# EAGLE design mainboard (EAGLE 8.0.0)
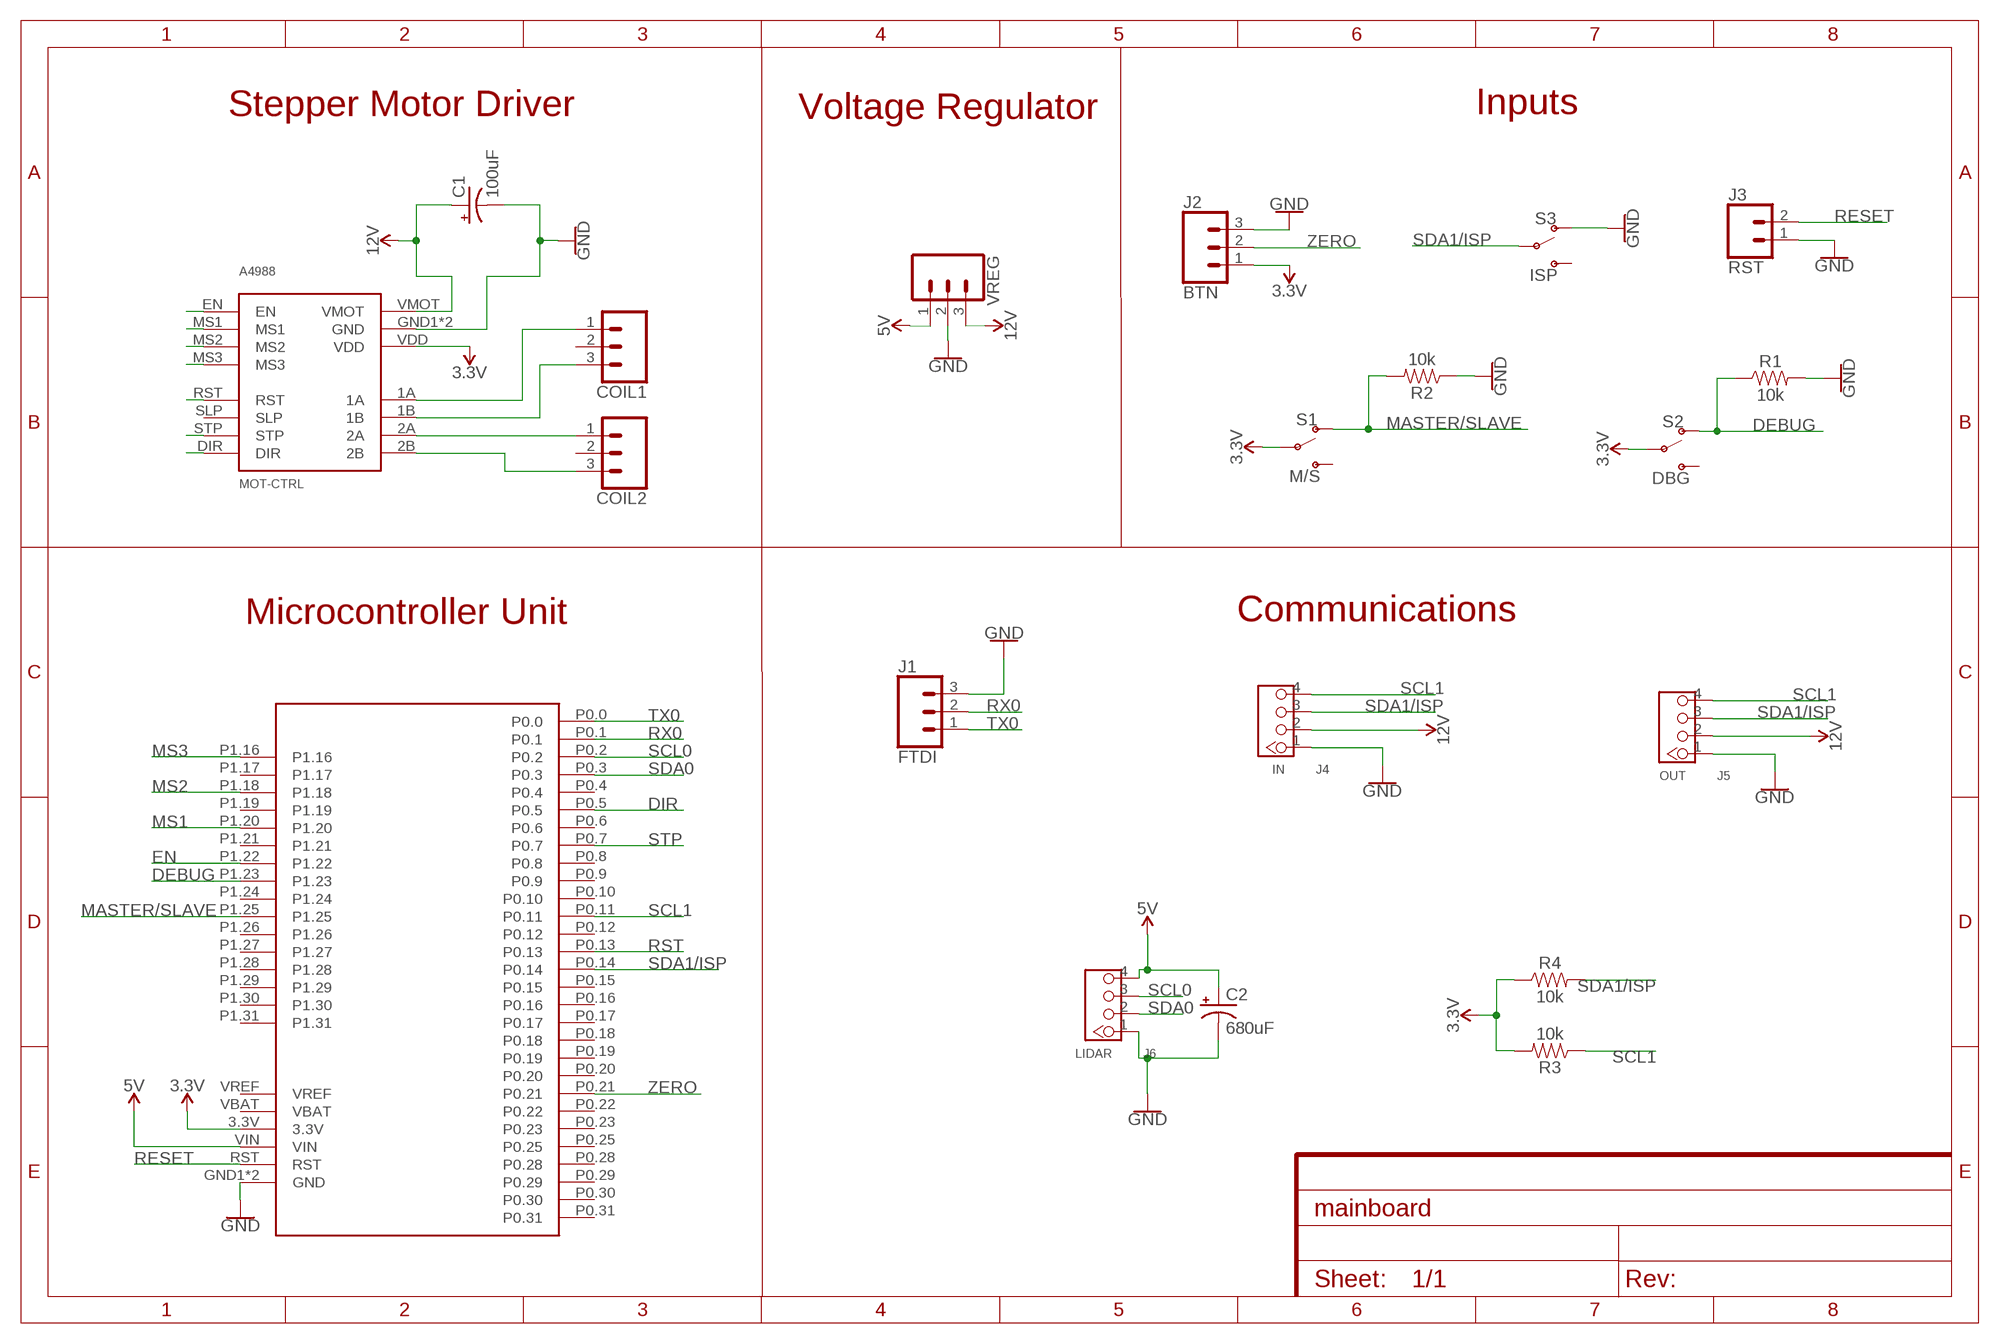
[diagram p0: schematic, sheet 1]
FRAME1 (FRAME-A4L): CNAME: AC3E; CREVISION: 2; DESIGNER: Javier Torres Bustos

## Parts
A4988  MOT-CTRL  [POLOLU-6X8]
C1  100uF  100UF-POLAR-RADIAL-2.5MM-25V-20%  [CPOL-RADIAL-2.5MM-6.5MM]
C2  680uF  100UF-POLAR-RADIAL-2.5MM-25V-20%  [CPOL-RADIAL-2.5MM-6.5MM]
COIL1  CONN_03-SCREW-5MM  [SCREWTERMINAL-5MM-3]
COIL2  CONN_03-SCREW-5MM  [SCREWTERMINAL-5MM-3]
J1  FTDI  CONN_03  [1X03]
J2  BTN  CONN_03  [1X03]
J3  RST  CONN_02  [1X02]
J4  IN  GROVE-CONNECTOR-DIP(4P-2.0)  [HW4-2.0]
J5  OUT  GROVE-CONNECTOR-DIP(4P-2.0)  [HW4-2.0]
J6  LIDAR  GROVE-CONNECTOR-DIP(4P-2.0)  [HW4-2.0]
LPC2148  MCU  [LPC-H2148]
R1  10k  10KOHM-HORIZ-1/4W-1%  [AXIAL-0.3]
R2  10k  10KOHM-HORIZ-1/4W-1%  [AXIAL-0.3]
R3  10k  10KOHM-HORIZ-1/4W-1%  [AXIAL-0.3]
R4  10k  10KOHM-HORIZ-1/4W-1%  [AXIAL-0.3]
S1  M/S  SWITCH-SPDT-PTH-11.6X4.0MM  [SWITCH_SPDT_PTH_11.6X4.0MM]
S2  DBG  SWITCH-SPDT-PTH-11.6X4.0MM  [SWITCH_SPDT_PTH_11.6X4.0MM]
S3  ISP  SWITCH-SPDT-PTH-11.6X4.0MM  [SWITCH_SPDT_PTH_11.6X4.0MM]
VREG  CONN_03  [1X03]

## Nets
3.3V: A4988.VDD J2.1 LPC2148.3.3V R3.P$2 R4.P$1 S1.2(P) S2.2(P)
5V: C2.1(+) J6.4 LPC2148.VIN VREG.1
12V: A4988.VMOT C1.1(+) J4.2 J5.2 VREG.3
DEBUG: LPC2148.P1.23 R1.P$1 S2.1(O)
DIR: A4988.DIR LPC2148.P0.5
EN: A4988.EN LPC2148.P1.22
GND: A4988.GND1(GND) A4988.GND2(GND) C1.2(-) C2.2(-) J1.3 J2.3 J3.1 J4.1 J5.1 J6.1 LPC2148.GND1(GND) LPC2148.GND2(GND) R1.P$2 R2.P$1 S3.1(O) VREG.2
MASTER/SLAVE: LPC2148.P1.25 R2.P$2 S1.1(O)
MS1: A4988.MS1 LPC2148.P1.20
MS2: A4988.MS2 LPC2148.P1.18
MS3: A4988.MS3 LPC2148.P1.16
N$1: A4988.2B COIL2.3
N$2: A4988.2A COIL2.1
N$3: A4988.1B COIL1.3
N$4: A4988.1A COIL1.1
RESET: J3.2 LPC2148.RST
RST: A4988.RST LPC2148.P0.13
RX0: J1.2 LPC2148.P0.1
SCL0: J6.3 LPC2148.P0.2
SCL1: J4.4 J5.4 LPC2148.P0.11 R3.P$1
SDA0: J6.2 LPC2148.P0.3
SDA1/ISP: J4.3 J5.3 LPC2148.P0.14 R4.P$2 S3.2(P)
STP: A4988.STP LPC2148.P0.7
TX0: J1.1 LPC2148.P0.0
ZERO: J2.2 LPC2148.P0.21
Unconnected: A4988.SLP COIL1.2 COIL2.2 LPC2148.P0.4 LPC2148.P0.6 LPC2148.P0.8 LPC2148.P0.9 LPC2148.P0.10 LPC2148.P0.12 LPC2148.P0.15 LPC2148.P0.16 LPC2148.P0.17 LPC2148.P0.18 LPC2148.P0.19 LPC2148.P0.20 LPC2148.P0.22 LPC2148.P0.23 LPC2148.P0.25 LPC2148.P0.28 LPC2148.P0.29 LPC2148.P0.30 LPC2148.P0.31 LPC2148.P1.17 LPC2148.P1.19 LPC2148.P1.21 LPC2148.P1.24 LPC2148.P1.26 LPC2148.P1.27 LPC2148.P1.28 LPC2148.P1.29 LPC2148.P1.30 LPC2148.P1.31 LPC2148.VBAT LPC2148.VREF S1.3(S) S2.3(S) S3.3(S)

## Notes on the sheet
- Stepper Motor Driver | Voltage Regulator | Inputs
- Microcontroller Unit | Communications

## Library data of the parts
A4988 = twizzy:MOT-CTRL
C1 = SparkFun-Capacitors:100UF-POLAR: 100µF polarized capacitors A capacitor is a passive two-terminal electrical component used to store electrical energy temporarily in an electric field.; PROD_ID: CAP-08439
C2 = SparkFun-Capacitors:100UF-POLAR: 100µF polarized capacitors A capacitor is a passive two-terminal electrical component used to store electrical energy temporarily in an electric field.; PROD_ID: CAP-08439; VALUE: 100uF
COIL1 COIL2 = SparkFun-Connectors:CONN_03: Multi connection point. Often used as Generic Header-pin footprint for 0.1 inch spaced/style header connections On any of the 0.1 inch spaced packages, you can populate with these: Break Away Headers - Straight <https://www.sparkfun.com/products/116> (PRT-00116) Break Away Male Headers - Right Angle <https://www.sparkfun.com/products/553> (PRT-00553) Female Headers <https://www.sparkfun.com/products/115> (PRT-00115) Break Away Headers - Machine Pin <https://www.sparkfun.com/products/117> (PRT-00117) Break Away Female Headers - Swiss Machine Pin <https://www.sparkfun.com/products/743> (PRT-00743) Stackable Header - 3 Pin (Female, 0.1") <https://www.sparkfun.com/products/13875> (PRT-13875) For SCREWTERMINALS and SPRING TERMINALS visit here: Screw Terimnals on SparkFun.com <https://www.sparkfun.com/search/results?term=Screw+Terminals> (5mm/3.5mm/2.54mm spacing) This device is also useful as a general connection point to wire up your design to another part of your project. Our various solder wires solder well into these plated through hole pads. Hook-Up Wire - Assortment (Stranded, 22 AWG) <https://www.sparkfun.com/products/11375> (PRT-11375) Hook-Up Wire - Assortment (Solid Core, 22 AWG) <https://www.sparkfun.com/products/11367> (PRT-11367) View the entire wire category on our website here <https://www.sparkfun.com/categories/141> Special notes: Molex polarized connector foot print use with SKU : PRT-08232 with associated crimp pins and housings.; PROD_ID: CONN-10134; SF_SKU: PRT-08433
J1 J2 VREG = SparkFun-Connectors:CONN_03: Multi connection point. Often used as Generic Header-pin footprint for 0.1 inch spaced/style header connections On any of the 0.1 inch spaced packages, you can populate with these: Break Away Headers - Straight <https://www.sparkfun.com/products/116> (PRT-00116) Break Away Male Headers - Right Angle <https://www.sparkfun.com/products/553> (PRT-00553) Female Headers <https://www.sparkfun.com/products/115> (PRT-00115) Break Away Headers - Machine Pin <https://www.sparkfun.com/products/117> (PRT-00117) Break Away Female Headers - Swiss Machine Pin <https://www.sparkfun.com/products/743> (PRT-00743) Stackable Header - 3 Pin (Female, 0.1") <https://www.sparkfun.com/products/13875> (PRT-13875) For SCREWTERMINALS and SPRING TERMINALS visit here: Screw Terimnals on SparkFun.com <https://www.sparkfun.com/search/results?term=Screw+Terminals> (5mm/3.5mm/2.54mm spacing) This device is also useful as a general connection point to wire up your design to another part of your project. Our various solder wires solder well into these plated through hole pads. Hook-Up Wire - Assortment (Stranded, 22 AWG) <https://www.sparkfun.com/products/11375> (PRT-11375) Hook-Up Wire - Assortment (Solid Core, 22 AWG) <https://www.sparkfun.com/products/11367> (PRT-11367) View the entire wire category on our website here <https://www.sparkfun.com/categories/141> Special notes: Molex polarized connector foot print use with SKU : PRT-08232 with associated crimp pins and housings.
J3 = SparkFun-Connectors:CONN_02: Multi connection point. Often used as Generic Header-pin footprint for 0.1 inch spaced/style header connections On any of the 0.1 inch spaced packages, you can populate with these: Break Away Headers - Straight <https://www.sparkfun.com/products/116> (PRT-00116) Break Away Male Headers - Right Angle <https://www.sparkfun.com/products/553> (PRT-00553) Female Headers <https://www.sparkfun.com/products/115> (PRT-00115) Break Away Headers - Machine Pin <https://www.sparkfun.com/products/117> (PRT-00117) Break Away Female Headers - Swiss Machine Pin <https://www.sparkfun.com/products/743> (PRT-00743) For SCREWTERMINALS and SPRING TERMINALS visit here: Screw Terimnals on SparkFun.com <https://www.sparkfun.com/search/results?term=Screw+Terminals> (5mm/3.5mm/2.54mm spacing) This device is also useful as a general connection point to wire up your design to another part of your project. Our various solder wires solder well into these plated through hole pads. Hook-Up Wire - Assortment (Stranded, 22 AWG) <https://www.sparkfun.com/products/11375> (PRT-11375) Hook-Up Wire - Assortment (Solid Core, 22 AWG) <https://www.sparkfun.com/products/11367> (PRT-11367) View the entire wire category on our website here <https://www.sparkfun.com/categories/141> Special notes: Molex polarized connector foot print use with: PRT-08233 with associated crimp pins and housings. 2.54_SCREWTERM for use with PRT-10571. 3.5mm Screw Terminal footprints for PRT-08084 5mm Screw Terminal footprints for use with PRT-08432
J4-J6 = Seeed-Connector -2016:GROVE-CONNECTOR-DIP(4P-2.0): 320110033; VALUE: 4P-2.0
LPC2148 = twizzy:MCU
R1-R4 = SparkFun-Resistors:10KOHM: 10kΩ resistor A resistor is a passive two-terminal electrical component that implements electrical resistance as a circuit element. Resistors act to reduce current flow, and, at the same time, act to lower voltage levels within circuits. - Wikipedia; PROD_ID: RES-12183
S1-S3 = SparkFun-Switches:SWITCH-SPDT: Single Pole, Double Throw (SPDT) Switch Single-pole, double-throw (SPDT) switch. Variant Overview SMD-AYZ0202 Surface Mount DPDT Switch <https://www.sparkfun.com/products/597> (COM-00597) Used on e.g. LilyPad Arduino USB - ATmega32U4 Board <https://www.sparkfun.com/products/12049> PTH-11.6X4.0MM SPDT Mini Power Switch <https://www.sparkfun.com/products/102> (COM-00102) Used on e.g. SparkFun Simon Says - Through-Hole Soldering Kit <https://www.sparkfun.com/products/10547> (KIT-10547) PTH-11.6X4.0MM-KIT KIT version of SPDT Mini Power Switch - Simplifies soldering by removing tStop of switch pins - only one side can be soldered. PTH-11.6X4.0MM-LOCK LOCK version of SPDT Mini Power Switch - Offset pins hold switch in place for easier soldering. SMD-RIGHT-ANGLE Surface Mount Right Angle Switch <https://www.sparkfun.com/products/10860> (COM-10860) Used on e.g. SparkFun ESP8266 Thing <https://www.sparkfun.com/products/13231>; PROD_ID: SWCH-08261; SF_SKU: COM-00102

## Board
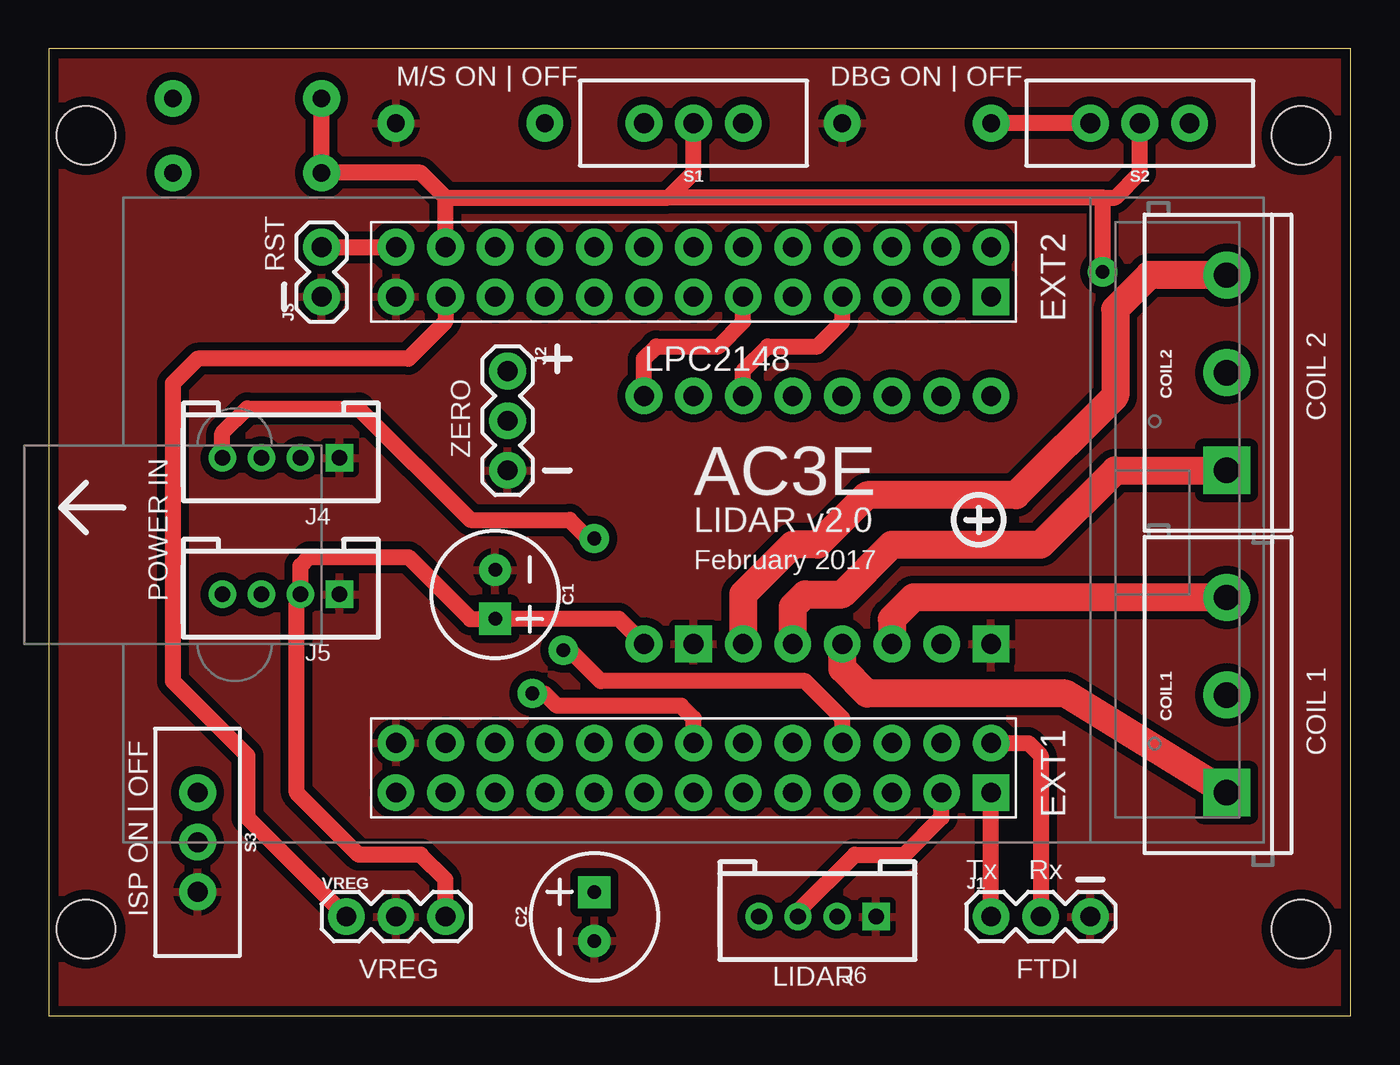
[diagram p1: board, top side]
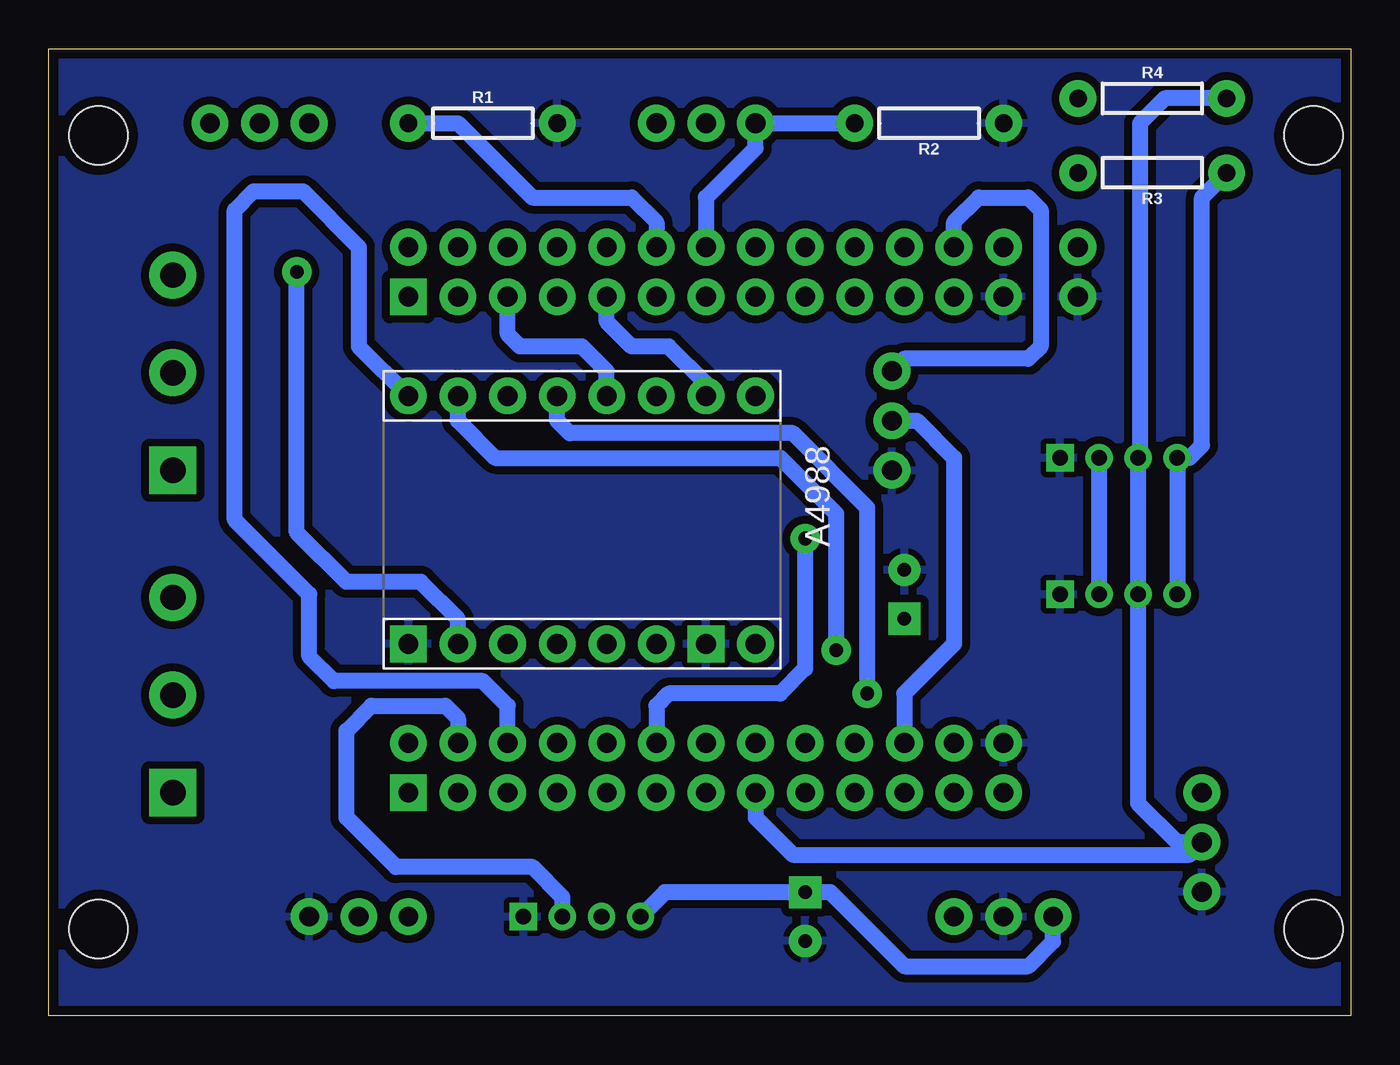
[diagram p2: board, bottom side, seen from below]

Size 66.67 x 49.53 mm. Coordinates in mm from the lower left corner, seen from the top.
Outline: 0,0 66.67,0 66.67,49.53 0,49.53 0,0
Copper layers (1*16): Top 0.035mm / dielectric 1.5mm / Bottom 0.035mm
Design rules "TectronixDRC": minimum track width 0.4mm, minimum drill 0.5mm, track to track 0.3mm, track to pad 0.3mm, pad to pad 0.3mm, via to via 0.3mm, smd to smd 0.3mm, copper to edge 0.5mm, drill to drill 0.5mm, minimum pad ring 0.3mm, minimum via ring 0.4mm, stop-mask expansion 0.1mm, vias tented up to drill 0.1mm, thermal gap 0.3mm
Holes 3 mm at 1.91,45.09 64.14,45.09 64.14,4.45 1.91,4.45

### Footprints (pad centres in the part's own frame; a part is rotated, then mirrored left to right if it is on the bottom)
POLOLU-6X8 = drill 1.016 pad 1.88: 1A 6.35,-1.27; 1B 6.35,-3.81; 2A 6.35,1.27; 2B 6.35,3.81; DIR -6.35,-8.89; EN -6.35,8.89; MS1 -6.35,6.35; MS2 -6.35,3.81; MS3 -6.35,1.27; RST -6.35,-1.27; SLP -6.35,-3.81; STP -6.35,-6.35; VDD 6.35,-6.35; VMOT 6.35,8.89 | drill 1.016 pad 1.88 square: GND1 6.35,6.35; GND2 6.35,-8.89
CPOL-RADIAL-2.5MM-6.5MM = drill 0.7 pad 1.651 square: 1 1.25,0 | drill 0.7 pad 1.651: 2 -1.25,0
SCREWTERMINAL-5MM-3 = drill 1.3 pad 2.413 square: 1 0,0 | drill 1.3 pad 2.413: 2 5,0; 3 10,0
1X03 = drill 1.016 pad 1.88: 1 0,0; 2 2.54,0; 3 5.08,0
1X02 = drill 1.016 pad 1.88: 1 0,0; 2 2.54,0
HW4-2.0 = drill 0.8 pad 1.27 square: 1 -3,0 | drill 0.8 pad 1.27: 2 -1,0; 3 1,0; 4 3,0
LPC-H2148 = drill 1.016 pad 1.88: 3.3V -12.7,15.24; GND1 -15.24,-10.16; GND2 -15.24,12.7; P0.1 15.24,-10.16; P0.2 12.7,-12.7; P0.3 12.7,-10.16; P0.4 10.16,-12.7; P0.5 10.16,-10.16; P0.6 7.62,-12.7; P0.7 7.62,-10.16; P0.8 5.08,-12.7; P0.9 5.08,-10.16; P0.10 2.54,-12.7; P0.11 2.54,-10.16; P0.12 0,-12.7; P0.13 0,-10.16; P0.14 -2.54,-12.7; P0.15 -2.54,-10.16; P0.16 -5.08,-12.7; P0.17 -5.08,-10.16; P0.18 -7.62,-12.7; P0.19 -7.62,-10.16; P0.20 -10.16,-12.7; P0.21 -10.16,-10.16; P0.22 -12.7,-12.7; P0.23 -12.7,-10.16; P0.25 -15.24,-12.7; P0.29 15.24,15.24; P0.30 12.7,12.7; P0.31 12.7,15.24; P1.16 10.16,12.7; P1.17 10.16,15.24; P1.18 7.62,12.7; P1.19 7.62,15.24; P1.20 5.08,12.7; P1.21 5.08,15.24; P1.22 2.54,12.7; P1.23 2.54,15.24; P1.24 0,12.7; P1.25 0,15.24; P1.26 -2.54,12.7; P1.27 -2.54,15.24; P1.28 -5.08,12.7; P1.29 -5.08,15.24; P1.30 -7.62,12.7; P1.31 -7.62,15.24; RST -15.24,15.24; VBAT -10.16,15.24; VIN -12.7,12.7; VREF -10.16,12.7 | drill 1.016 pad 1.88 square: P0.0 15.24,-12.7; P0.28 15.24,12.7
AXIAL-0.3 = drill 0.9 pad 1.88: P$1 -3.81,0; P$2 3.81,0
SWITCH_SPDT_PTH_11.6X4.0MM = drill 1.016 pad 1.88: 1 0,2.54; 2 0,0; 3 0,-2.54

### Placement (x,y rotation side)
A4988  39.37,25.4 270 bottom
C1  22.86,21.59 270 top
C2  27.94,5.08 90 top
COIL1  60.33,11.43 90 top
COIL2  60.33,27.94 90 top
J1  48.26,5.08 0 top
J2  23.5,33.02 270 top
J3  13.97,36.83 90 top
J4  11.89,28.57 180 top
J5  11.89,21.59 180 top
J6  39.37,5.08 180 top
LPC2148  33.02,24.13 0 top
R1  44.45,45.72 0 bottom
R2  21.59,45.72 180 bottom
R3  10.16,43.18 180 bottom
R4  10.16,46.99 0 bottom
S1  33.02,45.72 90 top
S2  55.88,45.72 90 top
S3  7.62,8.89 180 top
VREG  15.24,5.08 0 top

### Tracks (layer width: path | path; a pad name or v marks a point on that pad's centre or on a via)
3.3V  (via drill 0.7)
  Top 0.813: LPC2148.3.3V 20.32,41.91 | 20.32,41.91 19.05,43.18 R3.P$2 R4.P$1 | 20.32,41.91 31.75,41.91 | 31.75,41.91 33.02,43.18 S1.2 | 53.98,41.91 31.75,41.91 | S2.2 55.88,43.18 54.61,41.91 53.98,41.91 | v53.98,38.1 53.98,41.91
  Bottom 0.813: LPC2148.3.3V 20.32,40.64 19.05,41.91 16.51,41.91 15.88,41.27 15.88,34.29 16.51,33.66 22.86,33.66 J2.1 | A4988.VDD 45.72,20.32 47.62,22.23 51.44,22.23 53.98,24.77 v53.98,38.1
5V
  Top 0.813: LPC2148.VIN 20.32,35.56 18.41,33.66 7.62,33.66 6.35,32.38 6.35,17.14 10.16,13.34 10.16,10.16 VREG.1
  Bottom 0.813: VREG.1 15.24,3.81 16.51,2.54 22.86,2.54 26.65,6.33 C2.1 35.12,6.33 J6.4
12V
  Top 0.813: VREG.3 20.32,6.99 19.05,8.26 15.88,8.26 12.7,11.43 12.7,21.14 J5.2 12.89,23.05 13.34,23.5 18.41,23.5 21.59,20.32 23.48,20.32 C1.1 29.19,20.34 A4988.VMOT
  Bottom 0.813: J4.2 J5.2
DEBUG
  Top 0.813: S2.1 R1.P$1
  Bottom 0.813: R1.P$1 45.72,45.72 41.91,41.91 36.83,41.91 35.56,40.64 LPC2148.P1.23
DIR
  Bottom 0.813: LPC2148.P0.5 43.18,15.88 44.45,17.14 52.07,17.14 53.34,18.41 53.34,21.59 57.15,25.4 57.15,41.27 56.2,42.23 53.66,42.23 50.8,39.37 50.8,34.29 A4988.DIR
EN
  Top 0.813: A4988.EN 30.48,33.66 31.11,34.29 34.29,34.29 35.56,35.56 LPC2148.P1.22
GND
  pour Bottom (isolate 0.406): -0.64,50.16 67.31,50.16 67.31,-0.64 -0.64,-0.64
  pour Top (isolate 0.406): -1.27,50.8 67.94,50.8 67.94,-1.27 -1.27,-1.27
MASTER/SLAVE
  Bottom 0.813: LPC2148.P1.25 33.02,41.91 30.48,44.45 S1.1 R2.P$2
MS1
  Bottom 0.813: A4988.MS1 33.02,32.38 34.92,34.29 36.83,34.29 38.1,35.56 LPC2148.P1.20
MS2
  Top 0.813: A4988.MS2 35.56,33.02 36.83,34.29 39.37,34.29 40.64,35.56 LPC2148.P1.18
MS3
  Bottom 0.813: A4988.MS3 38.1,33.02 39.37,34.29 42.55,34.29 43.18,34.92 LPC2148.P1.16
N$1
  Top 1.422: COIL2.3 56.35,37.94 54.61,36.2 54.61,31.75 49.53,26.67 41.91,26.67 39.37,24.13 38.1,24.13 35.56,21.59 A4988.2B
N$2
  Top 1.422: COIL2.1 54.61,27.94 50.8,24.13 43.18,24.13 40.64,21.59 38.73,21.59 38.1,20.95 A4988.2A
N$3
  Top 1.422: COIL1.3 44.29,21.43 43.18,20.32 A4988.1B
N$4
  Top 1.422: COIL1.1 52.07,16.51 41.91,16.51 40.64,17.78 A4988.1A
RESET
  Top 0.813: J3.2 LPC2148.RST
RST  (via drill 0.7)
  Top 0.813: LPC2148.P0.13 33.02,15.24 32.38,15.88 26.04,15.88 25.4,16.51 v24.77,16.51
  Bottom 0.813: A4988.RST 40.64,30.48 40.01,29.84 28.57,29.84 24.77,26.04 v24.77,16.51
RX0
  Top 0.813: LPC2148.P0.1 50.16,13.97 50.8,13.34 J1.2
SCL0
  Top 0.813: J6.3 38.37,5.35 41.27,8.26 43.81,8.26 45.72,10.16 LPC2148.P0.2
SCL1  (via drill 0.7)
  Top 0.813: J4.4 8.89,29.84 10.16,31.11 15.88,31.11 21.59,25.4 26.67,25.4 27.62,24.45 v27.94,24.45
  Bottom 0.813: R3.P$1 7.62,41.91 7.62,29.21 8.26,28.57 J4.4 J5.4 | v27.94,24.45 27.94,17.78 29.21,16.51 34.92,16.51 35.56,15.88 LPC2148.P0.11
SDA0
  Bottom 0.813: J6.2 40.37,6.08 41.91,7.62 48.9,7.62 51.44,10.16 51.44,14.61 50.16,15.88 46.35,15.88 45.72,15.24 LPC2148.P0.3
SDA1/ISP
  Bottom 0.813: R4.P$2 9.53,46.99 10.79,45.72 10.79,28.67 J4.3 J5.3 10.89,10.89 8.89,8.89 S3.2 8.26,8.26 28.57,8.26 30.48,10.16 LPC2148.P0.14
STP  (via drill 0.7)
  Top 0.813: LPC2148.P0.7 40.64,15.24 38.73,17.14 28.26,17.14 26.67,18.73 v26.35,18.73
  Bottom 0.813: A4988.STP 45.72,30.48 43.81,28.57 29.21,28.57 26.35,25.72 v26.35,18.73
TX0
  Top 0.813: J1.1 LPC2148.P0.0
ZERO
  Bottom 0.813: J2.2 22.23,30.48 20.32,28.57 20.32,19.05 22.86,16.51 LPC2148.P0.21

### Text on the board
tPlace: M/S ON | OFF | DBG ON | OFF | RST | COIL 2 | POWER IN | ZERO | AC3E | LIDAR v2.0 | February 2017 | COIL 1 | Tx | Rx | ISP ON | OFF | LIDAR | VREG | FTDI